# EAGLE design 6 Function DCC Decoder V3 (EAGLE 9.6.2)
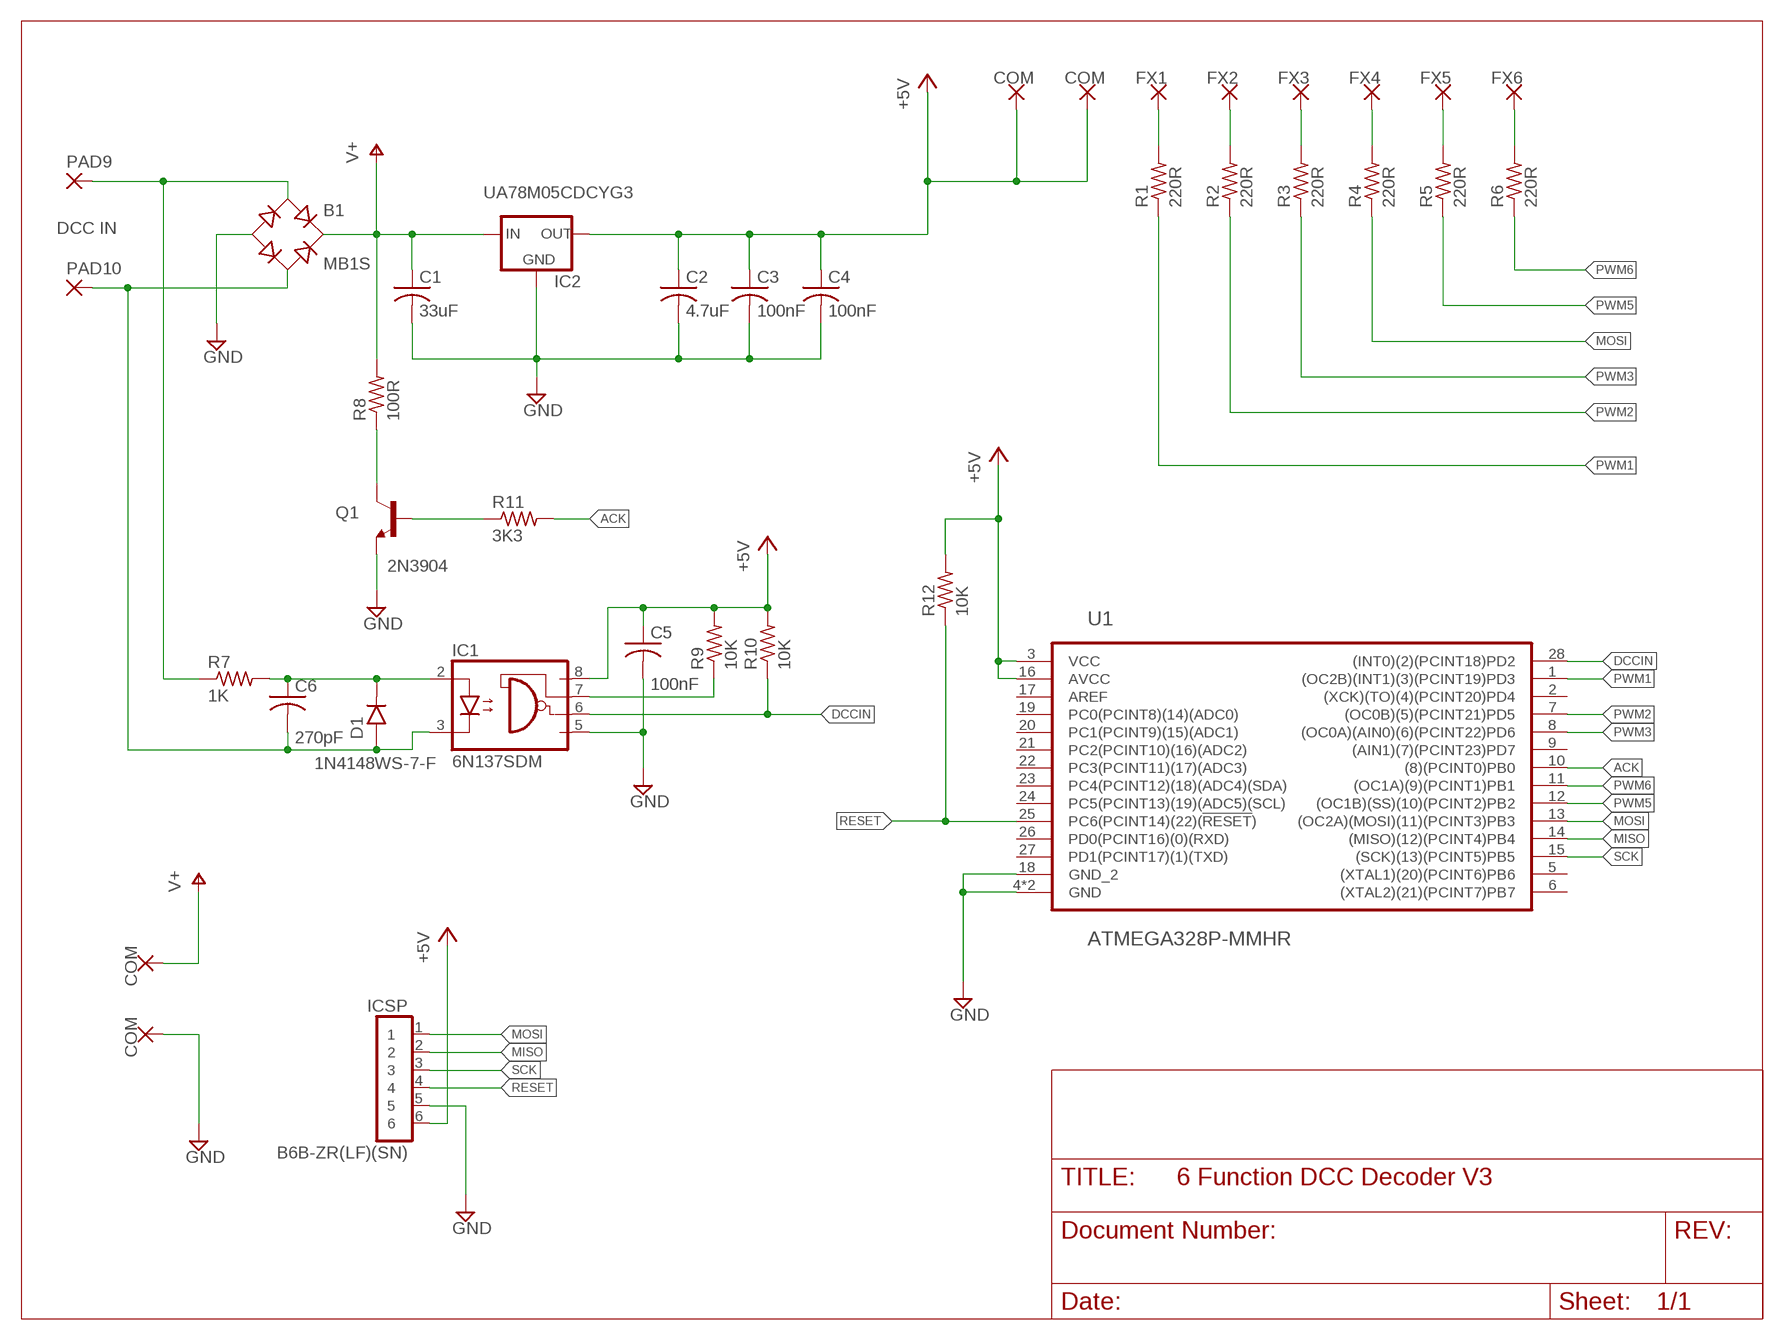
[diagram p0: schematic, sheet 1]

## Parts
B1  MB1S  [SOIC-4]
C1  33uF  C-USC1206  [C1206]
C2  4.7uF  C-USC0603K  [C0603K]
C3  100nF  C-USC0402K  [C0402K]
C4  100nF  C-USC0402K  [C0402K]
C5  100nF  C-USC0402K  [C0402K]
C6  270pF  C-USC0402K  [C0402K]
D1  1N4148WS-7-F  [SOD2513X120N]
IC1  6N137SDM  [SOP254P1030X508-8N]
IC2  UA78M05CDCYG3  [SOT230P700X180-4N]
ICSP  B6B-ZR(LF)(SN)  [JST_B6B-ZR(LF)(SN)]
PAD1  FX1  SMD2  [SMD1,27-2,54]
PAD2  FX2  SMD2  [SMD1,27-2,54]
PAD3  FX3  SMD2  [SMD1,27-2,54]
PAD4  FX4  SMD2  [SMD1,27-2,54]
PAD5  FX5  SMD2  [SMD1,27-2,54]
PAD6  FX6  SMD2  [SMD1,27-2,54]
PAD7  COM  SMD2  [SMD1,27-2,54]
PAD8  COM  SMD2  [SMD1,27-2,54]
PAD9  SMD2  [SMD1,27-2,54]
PAD10  SMD2  [SMD1,27-2,54]
PAD11  COM  SMD2  [SMD1,27-2,54]
PAD12  COM  SMD2  [SMD1,27-2,54]
Q1  2N3904  NPN-SOT23  [SOT23]
R1  220R  R-US_R0402  [R0402]
R2  220R  R-US_R0402  [R0402]
R3  220R  R-US_R0402  [R0402]
R4  220R  R-US_R0402  [R0402]
R5  220R  R-US_R0402  [R0402]
R6  220R  R-US_R0402  [R0402]
R7  1K  R-US_R0402  [R0402]
R8  100R  R-US_R1206  [R1206]
R9  10K  R-US_R0402  [R0402]
R10  10K  R-US_R0402  [R0402]
R11  3K3  R-US_R0402  [R0402]
R12  10K  R-US_R0402  [R0402]
U1  ATMEGA328P-MMHR  [QFN45P400X400X100-29N]

## Nets
+5V: C2.1 C3.1 C4.1 C5.1 IC1.8(VCC) IC2.3(OUT) ICSP.6 PAD7.1(P) PAD8.1(P) R9.2 R10.2 R12.2 U1.3(VCC) U1.16(AVCC)
ACK: R11.2 U1.10((8)(PCINT0)PB0)
ACKB: Q1.1(B) R11.1
DCCA: B1.~1(AC1) PAD9.1(P) R7.1
DCCA_: C6.1 D1.C IC1.2(A) R7.2
DCCB: B1.~2(AC2) C6.2 D1.A IC1.3(C) PAD10.1(P)
DCCIN: IC1.6(VO) R10.1 U1.28((INT0)(2)(PCINT18)PD2)
GND: B1.- C1.2 C2.2 C3.2 C4.2 C5.2 IC1.5(GND) IC2.2(GND) IC2.4(GND) ICSP.5 PAD12.1(P) Q1.2(E) U1.4(GND) U1.18(GND_2) U1.29(GND)
MISO: ICSP.2 U1.14((MISO)(12)(PCINT4)PB4)
MOSI: ICSP.1 R4.1 U1.13((OC2A)(MOSI)(11)(PCINT3)PB3)
N$2: PAD1.1(P) R1.2
N$3: PAD2.1(P) R2.2
N$4: PAD3.1(P) R3.2
N$5: PAD4.1(P) R4.2
N$6: PAD5.1(P) R5.2
N$7: PAD6.1(P) R6.2
N$13: IC1.7(VE) R9.1
N$15: Q1.3(C) R8.1
PWM1: R1.1 U1.1((OC2B)(INT1)(3)(PCINT19)PD3)
PWM2: R2.1 U1.7((OC0B)(5)(PCINT21)PD5)
PWM3: R3.1 U1.8((OC0A)(AIN0)(6)(PCINT22)PD6)
PWM5: R5.1 U1.12((OC1B)(SS)(10)(PCINT2)PB2)
PWM6: R6.1 U1.11((OC1A)(9)(PCINT1)PB1)
RESET: ICSP.4 R12.1 U1.25(PC6(PCINT14)(22)(!RESET!))
SCK: ICSP.3 U1.15((SCK)(13)(PCINT5)PB5)
V+: B1.+ C1.1 IC2.1(IN) PAD11.1(P) R8.2
Unconnected: U1.2((XCK)(TO)(4)(PCINT20)PD4) U1.5((XTAL1)(20)(PCINT6)PB6) U1.6((XTAL2)(21)(PCINT7)PB7) U1.9((AIN1)(7)(PCINT23)PD7) U1.17(AREF) U1.19(PC0(PCINT8)(14)(ADC0)) U1.20(PC1(PCINT9)(15)(ADC1)) U1.21(PC2(PCINT10)(16)(ADC2)) U1.22(PC3(PCINT11)(17)(ADC3)) U1.23(PC4(PCINT12)(18)(ADC4)(SDA)) U1.24(PC5(PCINT13)(19)(ADC5)(SCL)) U1.26(PD0(PCINT16)(0)(RXD)) U1.27(PD1(PCINT17)(1)(TXD))

## Notes on the sheet
- DCC IN

## Library data of the parts
B1 = rectifier:MB*S: Bridge Rectifier Source: http://www.fairchildsemi.com/ds/MB/MB6S.pdf
C1-C6 = rcl:C-US: CAPACITOR, American symbol; SPICEPREFIX: C
D1 = SnapEDA Library:1N4148WS-7-F: 1N4148WS Series 2 A 75 V 200 mW Surface Mount Fast Switching Diode - SOD-323; MANUFACTURER: Diodes Inc.
IC1 = SamacSys_Parts:6N137SDM: 10MBit/s Transistor Optocoupler DIP SMD8 Source: Datasheet <https://www.onsemi.com/pub/Collateral/HCPL2631M-D.pdf>; DESCRIPTION: 10MBit/s Transistor Optocoupler DIP SMD8; HEIGHT: 5.08mm; MANUFACTURER_NAME: onsemi; MANUFACTURER_PART_NUMBER: 6N137SDM; MOUSER_PART_NUMBER: 512-6N137SDM; MOUSER_PRICE-STOCK: https://www.mouser.co.uk/ProductDetail/ON-Semiconductor-Fairchild/6N137SDM?qs=wuRI32rFNSFC%252BTbDLj3kvw%3D%3D
IC2 = SamacSys_Parts:UA78M05CDCYG3: TEXAS INSTRUMENTS - UA78M05CDCYG3 . - Linear Voltage Regulator, 7805, Fixed, Positive Voltage, 7V To 25V In, 5V And 0.5A Out, SOT-223-3 Source: Datasheet <https://www.ti.com/lit/ds/symlink/ua78m.pdf?ts=1600084265750&ref_url=https%3A%2F%2Fwww.google.com%2F>; DESCRIPTION: TEXAS INSTRUMENTS - UA78M05CDCYG3 . - Linear Voltage Regulator, 7805, Fixed, Positive Voltage, 7V To 25V In, 5V And 0.5A Out, SOT-223-3; HEIGHT: 1.8mm; MANUFACTURER_NAME: Texas Instruments; MANUFACTURER_PART_NUMBER: UA78M05CDCYG3; MOUSER_PART_NUMBER: 595-UA78M05CDCYG3; MOUSER_PRICE-STOCK: https://www.mouser.co.uk/ProductDetail/Texas-Instruments/UA78M05CDCYG3?qs=0O%2FZFlpUpJW6iQLlsjczIw%3D%3D
ICSP = SnapEDA Library:B6B-ZR(LF)(SN): ZR Series 1.5 mm Pitch 6 Position Through Hole Top Entry Shrouded Heade; AVAILABILITY: Unavailable; DESCRIPTION: ZR Series 1.5 mm Pitch 6 Position Through Hole Top Entry Shrouded Header; MAXIMUM_PACKAGE_HEIGHT: 4.5mm; MF: JST Sales; MP: B6B-ZR_LF__SN_; PACKAGE: None; PRICE: None
PAD1-PAD12 = wirepad:SMD2: SMD PAD
Q1 = SPCoast:NPN: Transistor NPN BJT configuration in SOT23 package. MMBT2222 is the common NPN we use. Double check BCE configuration again layout.
R1-R12 = rcl:R-US_: RESISTOR, American symbol; SPICEPREFIX: R
U1 = Atmel:ATMEGA328P-MMHR

## Board
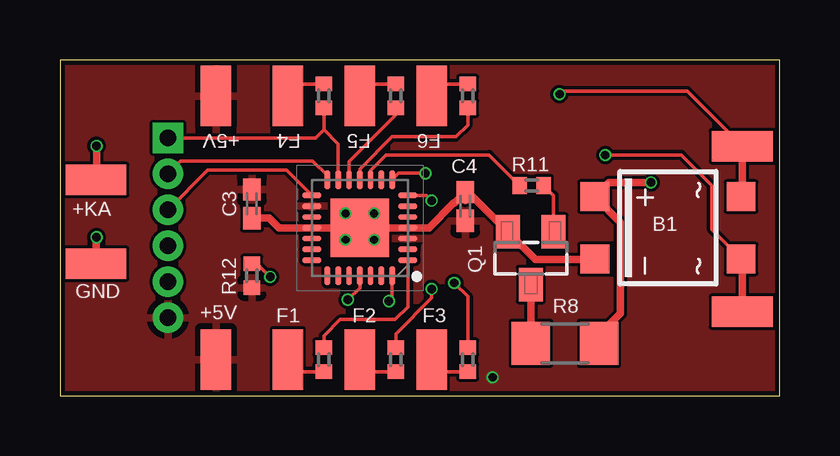
[diagram p1: board, top side]
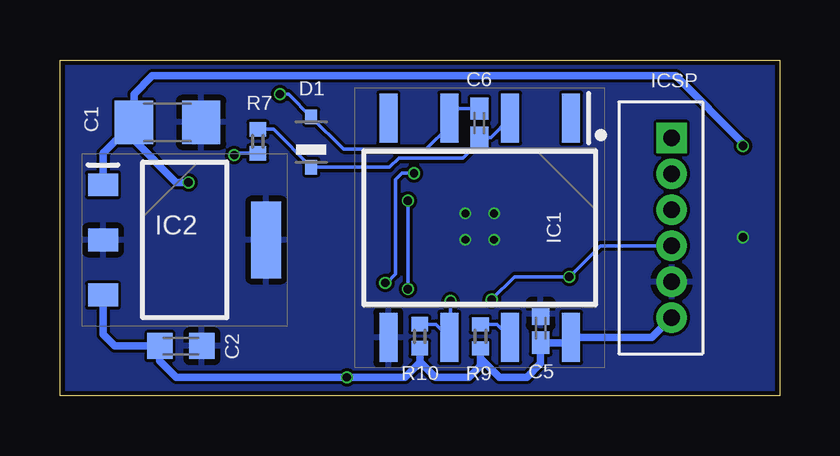
[diagram p2: board, bottom side, seen from below]

Size 30 x 14 mm. Coordinates in mm from the lower left corner, seen from the top.
Outline: 0,0 30,0 30,14 0,14 0,0
Copper layers (1*16): Top 0.035mm / dielectric 1.6mm / Bottom 0.035mm
Design rules "jlcpcb-2layers *": minimum track width 5mil, minimum drill 0.3mm, track to track 5mil, track to pad 5mil, pad to pad 5mil, via to via 5mil, smd to smd 5mil, copper to edge 0.2mm, drill to drill 6mil, minimum pad ring 10mil, minimum via ring 3mil, stop-mask expansion 4mil, vias tented up to drill 15mil, thermal gap 10mil

### Footprints (pad centres in the part's own frame; a part is rotated, then mirrored left to right if it is on the bottom)
SOIC-4 = smd 1.2 x 1.2: + 1.3,3.05; - -1.3,3.05; ~1 -1.3,-3.05; ~2 1.3,-3.05
C1206 = smd 1.6 x 1.8: 1 -1.4,0; 2 1.4,0
C0603K = smd 1.05 x 1.08: 1 -0.875,0; 2 0.875,0
C0402K = smd 0.925 x 0.74: 1 -0.6,0; 2 0.6,0
SOD2513X120N = smd 0.6 x 0.5: A 1.05,0; C -1.05,0
SOP254P1030X508-8N = smd 2.05 x 0.75: 1 -4.575,3.81; 2 -4.575,1.27; 3 -4.575,-1.27; 4 -4.575,-3.81; 5 4.575,-3.81; 6 4.575,-1.27; 7 4.575,1.27; 8 4.575,3.81
SOT230P700X180-4N = smd 1.25 x 0.95: 1 -3.4,2.3; 2 -3.4,0; 3 -3.4,-2.3 | smd 1.25 x 3.2: 4 3.4,0
JST_B6B-ZR(LF)(SN) = drill 0.7 square: 1 3.75,0 | drill 0.7: 2 2.25,0; 3 0.75,0; 4 -0.75,0; 5 -2.25,0; 6 -3.75,0
SMD1,27-2,54 = smd 1.27 x 2.54: 1 0,0
SOT23 = smd 1.4 x 1: 1 1.1,-0.95; 2 1.1,0.95; 3 -1.1,0
R0402 = smd 0.6 x 0.7: 1 -0.5,0; 2 0.5,0
R1206 = smd 1.6 x 1.803: 1 -1.422,0; 2 1.422,0
QFN45P400X400X100-29N = smd 0.8 x 0.25: 1 -2,1.35; 2 -2,0.9; 3 -2,0.45; 4 -2,0; 5 -2,-0.45; 6 -2,-0.9; 7 -2,-1.35; 15 2,-1.35; 16 2,-0.9; 17 2,-0.45; 18 2,0; 19 2,0.45; 20 2,0.9; 21 2,1.35 | smd 0.25 x 0.8: 8 -1.35,-2; 9 -0.9,-2; 10 -0.45,-2; 11 0,-2; 12 0.45,-2; 13 0.9,-2; 14 1.35,-2; 22 1.35,2; 23 0.9,2; 24 0.45,2; 25 0,2; 26 -0.45,2; 27 -0.9,2; 28 -1.35,2 | smd 2.45 x 2.45: 29 0,0

### Placement (x,y rotation side)
B1  25.35,7 90 top
C1  25.52,11.4 0 bottom
C2  24.96,2.06 0 bottom
C3  8,8 270 top
C4  16.9,7.89 90 top
C5  9.96,2.81 90 bottom
C6  12.51,11.37 90 bottom
D1  19.52,10.57 90 bottom
IC1  12.5,7 270 bottom
IC2  24.8,6.49 0 bottom
ICSP  4.5,7 90 bottom
PAD1  9.5,1.5 0 top
PAD2  12.5,1.5 0 top
PAD3  15.5,1.5 0 top
PAD4  9.5,12.5 0 top
PAD5  12.5,12.5 0 top
PAD6  15.5,12.5 0 top
PAD7  6.5,12.5 0 top
PAD8  6.5,1.5 0 top
PAD9  28.45,3.5 90 top
PAD10  28.45,10.4 90 top
PAD11  1.5,9 90 top
PAD12  1.5,5.5 90 top
Q1  19.63,5.73 90 top
R1  11,1.5 270 top
R2  14,1.5 270 top
R3  17,1.5 270 top
R4  11,12.5 90 top
R5  14,12.5 90 top
R6  17,12.5 90 top
R7  21.75,10.61 90 bottom
R8  21.05,2.17 0 top
R9  12.47,2.47 270 bottom
R10  15,2.47 270 bottom
R11  19.66,8.77 180 top
R12  8,5 270 top
U1  12.5,7 180 top

### Tracks (layer width: path | path; a pad name or v marks a point on that pad's centre or on a via)
+5V  (via drill 0.35)
  Top 0.152: 10.47,7.87 U1.16
  Top 0.305: C4.1 16.76,7.14 | PAD8.1 6.25,1.5
  Bottom 0.305: ICSP.6 5.33,2.42 IC1.8 8.69,2.21 C5.1 9.96,1.34 10.54,0.76 11.68,0.76 12.47,1.55 R9.2 | 12.47,1.62 R9.2 | IC2.3 28.2,2.55 27.72,2.06 C2.1 25.84,1.45 25.15,0.76 v18.03,0.76 15.62,0.76 15,1.38 R10.2 15,1.41 14.35,0.76 12.95,0.76 12.47,1.24 R9.2
  pour Top: 0,0 0,13.97 30,14 30,0
ACK
  Top 0.152: U1.10 12.95,9.39 13.59,10.03 17.89,10.03 R11.2
ACKB
  Top 0.152: R11.1 20.58,8.35 Q1.1
DCCA  (via drill 0.35)
  Top 0.152: B1.~1 27.18,6.92 27.18,8.76 25.91,10.03 v22.73,10.03
  Top 0.305: 28.92,3.02 PAD9.1 28.45,5.65 B1.~1
  Bottom 0.152: v22.73,10.03 22.66,10.11 R7.1
DCCA_
  Bottom 0.152: IC1.2 12.04,10.77 C6.1 12.51,10.6 13.21,9.91 15.88,9.91 16.26,9.53 D1.C 21.1,11.11 R7.2
DCCB  (via drill 0.35)
  Top 0.152: PAD10.1 26.15,12.7 20.95,12.7 v20.83,12.57
  Top 0.305: 28.92,10.88 PAD10.1 28.45,8.35 B1.~2
  Bottom 0.152: C6.2 13.38,11.96 IC1.3 13.77,11.25 14.73,10.29 18.18,10.29 D1.A 20.47,12.57 v20.83,12.57
DCCIN  (via drill 0.35)
  Top 0.152: U1.28 13.85,4.07 v13.72,3.94
  Bottom 0.152: 13.77,1.93 IC1.6 | v13.72,3.94 13.72,2.48 IC1.6 | R10.1 14.32,2.97 IC1.6
GND  (via drill 0.33, 0.35)
  Top 0.152: B1.- 22.32,5.68 22.35,5.64
  Top 0.305: U1.29 12.5,6.5 12,6.5 | 12,6.5 v11.9,6.5 | C3.2 8.73,7.4 9.13,7 U1.18 11.5,7 12,6.5 | v13.1,6.5 13.6,7 U1.4 15.38,7 16.41,8.03 16.44,8.03 C4.2 | PAD12.1 1.5,6.58 v1.52,6.6 | C4.2 | C4.2 17.02,8.49 17.2,8.31 | 17.2,8.31 Q1.2 19.83,5.68 22.32,5.68 | 16.9,8.14 C4.2 | 16.82,8.31 17.2,8.31
  other vias: 11.9,7.6 13.1,7.6
  pour Bottom (rank 2): 0,14 30,14 30,0 0,0
MISO
  Top 0.152: ICSP.2 5.03,9.78 10.54,9.78 11.15,9.17 U1.14
MOSI
  Top 0.152: R4.1 11,11.1 | U1.13 11.6,10.5 11,11.1 | ICSP.1 10.65,10.75 11,11.1
N$2
  Top 0.152: R1.2 10,1 PAD1.1
N$3
  Top 0.152: R2.2 13,1 PAD2.1
N$4
  Top 0.152: R3.2 16,1 PAD3.1
N$5
  Top 0.152: R4.2 10,13 PAD4.1
N$6
  Top 0.152: PAD5.1 13,13 R5.2
N$7
  Top 0.152: R6.2 16,13 PAD6.1
N$13
  Bottom 0.152: R9.1 11.78,2.97 IC1.7
N$15
  Top 0.305: Q1.3 R8.1
PWM1
  Top 0.152: 14.48,5.63 U1.1 14.5,3.71 13.97,3.17 11.68,3.17 11,2.49 R1.1
PWM2  (via drill 0.35)
  Top 0.152: R2.1 14,2.57 15.49,4.06 v15.49,4.45 | U1.7 15.27,8.35 v15.49,8.13
  Bottom 0.152: v15.49,4.45 v15.49,8.13
PWM3  (via drill 0.35)
  Top 0.152: U1.8 14.12,9.27 v15.24,9.27 | v16.44,4.7 17,4.14 R3.1
  Bottom 0.152: v15.24,9.27 15.75,9.27 16,9.02 16,5.07 16.38,4.7 v16.44,4.7 16.51,4.7
PWM5
  Top 0.152: R5.1 14,11.71 12.05,9.76 U1.12
PWM6
  Top 0.152: U1.11 12.5,9.45 13.84,10.79 16.51,10.79 17,11.29 R6.1
RESET  (via drill 0.35)
  Top 0.152: v12,4 12.5,4.5 U1.25 | 8.02,5.48 R12.1 8.22,5.5 v8.76,4.95
  Bottom 0.152: ICSP.4 7.47,6.25 v8.76,4.95 11.05,4.95 v12,4
SCK
  Top 0.152: U1.15 9.45,9.4 6.15,9.4 ICSP.3
V+  (via drill 0.35)
  Top 0.152: 22.49,2.17 R8.2
  Top 0.305: v1.52,10.41 1.52,9.02 PAD11.1 | v24.64,8.89 22.89,8.89 B1.+ 23.37,7.23 23.37,3.43 22.48,2.54 R8.2
  Bottom 0.305: v1.52,10.41 1.52,10.54 4.32,13.34 26.16,13.34 26.92,12.58 C1.1 | C1.1 28.2,10.11 IC2.1 | C1.1 26.92,10.66 25.15,8.89 v24.64,8.89

### Text on the board
tNames: +5V | F4 | F5 | F6 | +KA | GND | +5V | F1 | F2 | F3